# EAGLE schematic Maxim_7219_LED_display_KingBright_7_segment_SC39_11SRWA_v1_1 (EAGLE 7.0.0)
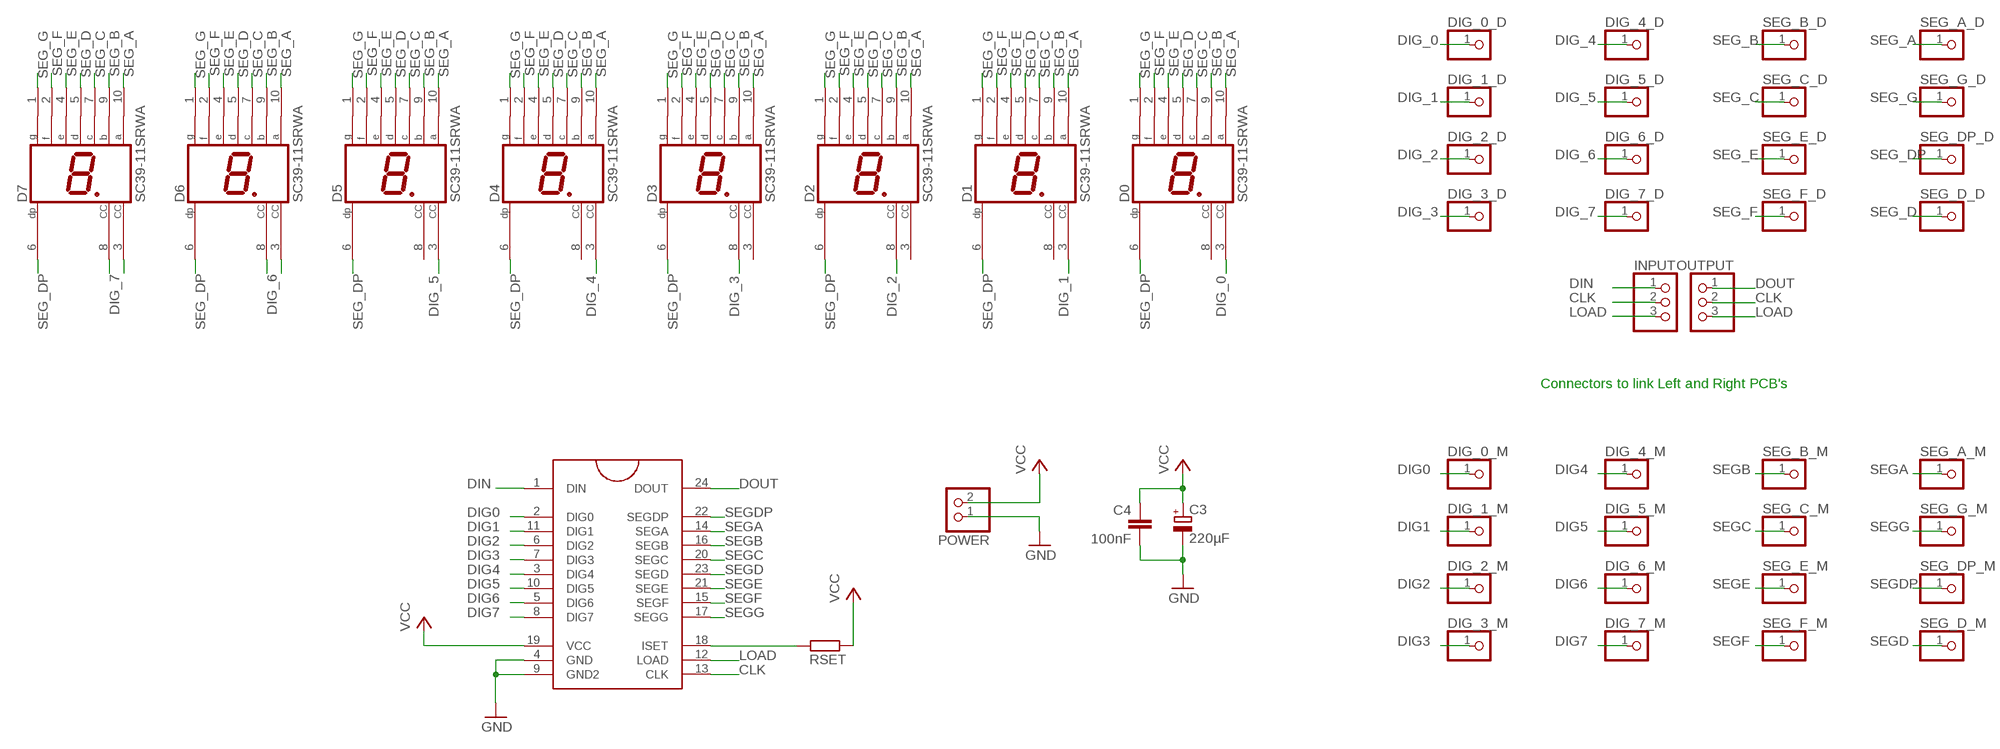
[diagram p0: schematic, sheet 1]

## Parts
C3  220µF  CPOL-EUE3.5-8  [E3,5-8]
C4  100nF  C-EU050-025X075  [C050-025X075]
D0  SC39-11SRWA  [HDSP-E]
D1  SC39-11SRWA  [HDSP-E]
D2  SC39-11SRWA  [HDSP-E]
D3  SC39-11SRWA  [HDSP-E]
D4  SC39-11SRWA  [HDSP-E]
D5  SC39-11SRWA  [HDSP-E]
D6  SC39-11SRWA  [HDSP-E]
D7  SC39-11SRWA  [HDSP-E]
DIG_0_D  PINHD-1X1  [1X01]
DIG_0_M  PINHD-1X1  [1X01]
DIG_1_D  PINHD-1X1  [1X01]
DIG_1_M  PINHD-1X1  [1X01]
DIG_2_D  PINHD-1X1  [1X01]
DIG_2_M  PINHD-1X1  [1X01]
DIG_3_D  PINHD-1X1  [1X01]
DIG_3_M  PINHD-1X1  [1X01]
DIG_4_D  PINHD-1X1  [1X01]
DIG_4_M  PINHD-1X1  [1X01]
DIG_5_D  PINHD-1X1  [1X01]
DIG_5_M  PINHD-1X1  [1X01]
DIG_6_D  PINHD-1X1  [1X01]
DIG_6_M  PINHD-1X1  [1X01]
DIG_7_D  PINHD-1X1  [1X01]
DIG_7_M  PINHD-1X1  [1X01]
INPUT  PINHD-1X3  [1X03]
OUTPUT  PINHD-1X3  [1X03]
POWER  PINHD-1X2  [1X02]
RSET  R-EU_0207/10  [0207/10]
SEG_A_D  PINHD-1X1  [1X01]
SEG_A_M  PINHD-1X1  [1X01]
SEG_B_D  PINHD-1X1  [1X01]
SEG_B_M  PINHD-1X1  [1X01]
SEG_C_D  PINHD-1X1  [1X01]
SEG_C_M  PINHD-1X1  [1X01]
SEG_D_D  PINHD-1X1  [1X01]
SEG_D_M  PINHD-1X1  [1X01]
SEG_DP_D  PINHD-1X1  [1X01]
SEG_DP_M  PINHD-1X1  [1X01]
SEG_E_D  PINHD-1X1  [1X01]
SEG_E_M  PINHD-1X1  [1X01]
SEG_F_D  PINHD-1X1  [1X01]
SEG_F_M  PINHD-1X1  [1X01]
SEG_G_D  PINHD-1X1  [1X01]
SEG_G_M  PINHD-1X1  [1X01]
U$3  MAX7219DIP  [DIL24]

## Nets
CLK: INPUT.2 OUTPUT.2 U$3.13(CLK)
DIG0: DIG_0_M.1 U$3.2(DIG0)
DIG1: DIG_1_M.1 U$3.11(DIG1)
DIG2: DIG_2_M.1 U$3.6(DIG2)
DIG3: DIG_3_M.1 U$3.7(DIG3)
DIG4: DIG_4_M.1 U$3.3(DIG4)
DIG5: DIG_5_M.1 U$3.10(DIG5)
DIG6: DIG_6_M.1 U$3.5(DIG6)
DIG7: DIG_7_M.1 U$3.8(DIG7)
DIG_0: D0.3(CC) DIG_0_D.1
DIG_1: D1.3(CC) DIG_1_D.1
DIG_2: D2.8(CC) DIG_2_D.1
DIG_3: D3.8(CC) DIG_3_D.1
DIG_4: D4.3(CC) DIG_4_D.1
DIG_5: D5.3(CC) DIG_5_D.1
DIG_6: D6.8(CC) DIG_6_D.1
DIG_7: D7.8(CC) DIG_7_D.1
DIN: INPUT.1 U$3.1(DIN)
DOUT: OUTPUT.1 U$3.24(DOUT)
GND: C3.- C4.2 POWER.1 U$3.4(GND) U$3.9(GND2)
LOAD: INPUT.3 OUTPUT.3 U$3.12(LOAD)
N$1: D6.3(CC)
N$8: D7.3(CC)
N$9: RSET.2 U$3.18(ISET)
SEG_A: D0.10(A) D1.10(A) D2.10(A) D3.10(A) D4.10(A) D5.10(A) D6.10(A) D7.10(A) SEG_A_D.1
SEG_B: D0.9(B) D1.9(B) D2.9(B) D3.9(B) D4.9(B) D5.9(B) D6.9(B) D7.9(B) SEG_B_D.1
SEG_C: D0.7(C) D1.7(C) D2.7(C) D3.7(C) D4.7(C) D5.7(C) D6.7(C) D7.7(C) SEG_C_D.1
SEG_D: D0.5(D) D1.5(D) D2.5(D) D3.5(D) D4.5(D) D5.5(D) D6.5(D) D7.5(D) SEG_D_D.1
SEG_DP: D0.6(DP) D1.6(DP) D2.6(DP) D3.6(DP) D4.6(DP) D5.6(DP) D6.6(DP) D7.6(DP) SEG_DP_D.1
SEG_E: D0.4(E) D1.4(E) D2.4(E) D3.4(E) D4.4(E) D5.4(E) D6.4(E) D7.4(E) SEG_E_D.1
SEG_F: D0.2(F) D1.2(F) D2.2(F) D3.2(F) D4.2(F) D5.2(F) D6.2(F) D7.2(F) SEG_F_D.1
SEG_G: D0.1(G) D1.1(G) D2.1(G) D3.1(G) D4.1(G) D5.1(G) D6.1(G) D7.1(G) SEG_G_D.1
SEGA: SEG_A_M.1 U$3.14(SEGA)
SEGB: SEG_B_M.1 U$3.16(SEGB)
SEGC: SEG_C_M.1 U$3.20(SEGC)
SEGD: SEG_D_M.1 U$3.23(SEGD)
SEGDP: SEG_DP_M.1 U$3.22(SEGDP)
SEGE: SEG_E_M.1 U$3.21(SEGE)
SEGF: SEG_F_M.1 U$3.15(SEGF)
SEGG: SEG_G_M.1 U$3.17(SEGG)
VCC: C3.+ C4.1 POWER.2 RSET.1 U$3.19(VCC)
Unconnected: D0.8(CC) D1.8(CC) D2.3(CC) D3.3(CC) D4.8(CC) D5.8(CC)

## Notes on the sheet
- Connectors to link Left and Right PCB's

## Library data of the parts
C3 = rcl:CPOL-EU: POLARIZED CAPACITOR, European symbol
C4 = rcl:C-EU: CAPACITOR, European symbol
D0 D1-D7 = display-hp:SC39-11SRWA: SINGLE DIGIT NUMERIC DISPLAY 9.9mm (0.39INCH) Source: SC39-11SRWA.pdf; OC_FARNELL: unknown; OC_NEWARK: unknown
DIG_0_D DIG_0_M DIG_1_D DIG_1_M DIG_2_D DIG_2_M DIG_3_D DIG_3_M DIG_4_D DIG_4_M DIG_5_D DIG_5_M DIG_6_D DIG_6_M DIG_7_D DIG_7_M SEG_A_D SEG_A_M SEG_B_D SEG_B_M SEG_C_D SEG_C_M SEG_D_D SEG_D_M SEG_DP_D SEG_DP_M SEG_E_D SEG_E_M SEG_F_D SEG_F_M SEG_G_D SEG_G_M = pinhead:PINHD-1X1: PIN HEADER
INPUT OUTPUT = pinhead:PINHD-1X3: PIN HEADER
POWER = pinhead:PINHD-1X2: PIN HEADER
RSET = rcl:R-EU_: RESISTOR, European symbol
U$3 = SparkFun-DigitalIC:MAX7219: 8-digit, 8-segment LED display driver, serial input